# Altium schematic sheet LTE.SchDoc: LTE
size A4; DrawnBy: Muhammet YILDIZ; Organization: YıLDıZ IoT; Revision: 1.1; SheetNumber: 6; SheetTotal: 7; SheetSize: A4
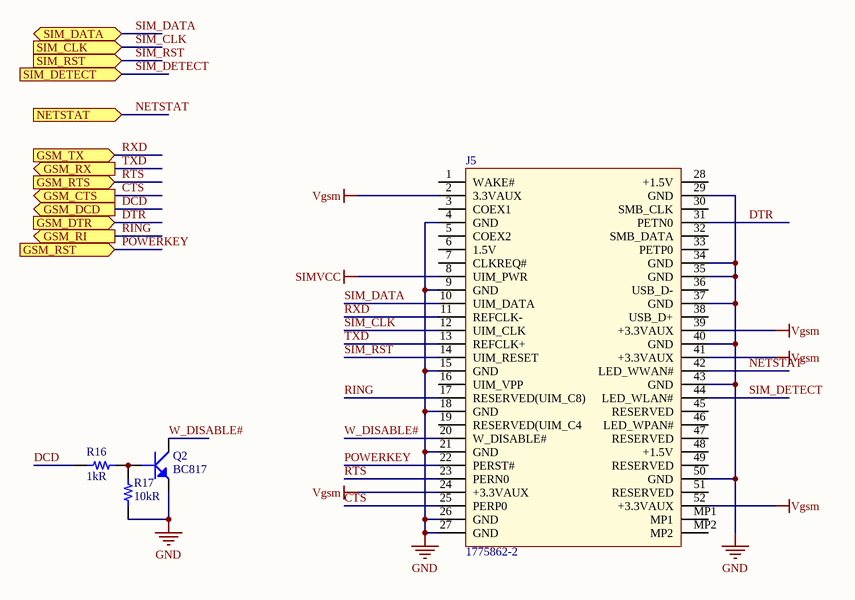
[diagram p0: LTE.SchDoc]

## Parts
J5  1775862-2  [TE 1775862-2]
Q2  BC817  [SOT23-3]
R16  1kR  [RES 0603/1608]
R17  10kR  [RES 0603/1608]

## Ports
GSM_CTS (out), GSM_DCD (out), GSM_DTR (in), GSM_RI (out), GSM_RST (in), GSM_RTS (in), GSM_RX (out), GSM_TX (in), NETSTAT (in), SIM_CLK (in), SIM_DATA (bidir), SIM_DETECT (in), SIM_RST (in)

## Nets
GND: J5.4(GND) J5.9(GND) J5.15(GND) J5.18(GND) J5.21(GND) J5.26(GND) J5.27(GND) J5.29(GND) J5.34(GND) J5.35(GND) J5.37(GND) J5.40(GND) J5.43(GND) J5.50(GND) Q2.2(E) R17.1
SIMVCC: J5.8(UIM_PWR)
Vgsm: J5.2(3.3VAUX) J5.24(+3.3VAUX) J5.39(+3.3VAUX) J5.41(+3.3VAUX) J5.52(+3.3VAUX)
CTS: J5.25(PERP0) ; port GSM_CTS
DCD: R16.2 ; port GSM_DCD
DTR: J5.31(PETN0) ; port GSM_DTR
NETSTAT: J5.42(LED_WWAN#) ; port NETSTAT
POWERKEY: J5.22(PERST#) ; port GSM_RST
RING: J5.17(RESERVED(UIM_C8)) ; port GSM_RI
RTS: J5.23(PERN0) ; port GSM_RTS
RXD: J5.11(REFCLK-) ; port GSM_TX
SIM_CLK: J5.12(UIM_CLK) ; port SIM_CLK
SIM_DATA: J5.10(UIM_DATA) ; port SIM_DATA
SIM_DETECT: J5.44(LED_WLAN#) ; port SIM_DETECT
SIM_RST: J5.14(UIM_RESET) ; port SIM_RST
TXD: J5.13(REFCLK+) ; port GSM_RX
W_DISABLE#: J5.20(W_DISABLE#) Q2.3(C)
NetQ2_1: Q2.1(B) R16.1 R17.2

Not connected (* = marked no-connect by the designer): J5 1(WAKE#) 3(COEX1) 5(COEX2) 6(1.5V) 7(CLKREQ#) 16(UIM_VPP) 19(RESERVED(UIM_C4) 28(+1.5V) 30(SMB_CLK) 32(SMB_DATA) 33(PETP0) 36(USB_D-) 38(USB_D+) 45(RESERVED) 46(LED_WPAN#) 47(RESERVED) 48(+1.5V) 49(RESERVED) 51(RESERVED) MP1 MP2

## Notes on the sheet
- Title:
- Size:
- Project:
- Revision:
- Sheet
- of
- Date:
- YıLDıZ IoT
- Elperek Mahallesi
- Saray Sokak, No:12
- SAKARYA / TURKEY
- File:

## Library data of the parts
J5 = Mini PCIe: Manufacturer: TE Connectivity; Number of Contacts: 52; Connector Type: Receptacle; High Temperature Housing: Yes; PCB Mount Retention: Without; PCB Mounting Orientation: Horizontal; Stackable: No; Pitch: 0.8mm; Row Spacing: 0.031inch; Stack Height: 5.2mm; Supplier 1: Digi-Key; Supplier Part Number 1: A142273CT-ND; Manufacturer Part Number: 1775862-2; Stock 1: 11289; Pricing 1: 1 = 0,77000, 10 = 0,72000, 25 = 0,64840, 50 = 0,57620, 100 = 0,55230, 250 = 0,50424 (USD); RoHS: Yes; Mount: Surface Mount; Contact Plating: Gold; Contact Material: Copper Alloy; Housing Material: Thermoplastic; Housing Color: Black; Termination: Solder; Number of Rows: 2; Packaging: Tape and Reel; Orientation: Right Angle; Number of Positions: 52; Package Quantity: 550; Radiation Hardening: No; Flammability Rating: UL94 V-0; Lead Free: Contains Lead; ELV: Compliant; ComponentLink1URL: http://www.farnell.com/datasheets/2645681.pdf?src-supplier=Farnell; ComponentLink1Description: http://www.farnell.com/datasheets/2645681.pdf?src-supplier=Farnell; ComponentLink2URL: http://components.arrow.com/part/dataview/0323_06583025?src-supplier=Arrow+Europe; ComponentLink2Description: http://components.arrow.com/part/dataview/0323_06583025?src-supplier=Arrow+Europe; ComponentLink3URL: http://www.onlinecomponents.com/datasheet/17758622.aspx?p=10266609&src-supplier=Onlinecomponents.com; ComponentLink3Description: http://www.onlinecomponents.com/datasheet/17758622.aspx?p=10266609&src-supplier=Onlinecomponents.com; ComponentLink4URL: http://components.arrow.com/part/dataview/47764795S8999339N5665?src-supplier=Arrow+Electronics; ComponentLink4Description: http://components.arrow.com/part/dataview/47764795S8999339N5665?src-supplier=Arrow+Electronics; ComponentLink5URL: https://www.te.com/commerce/DocumentDelivery/DDEController?Action=srchrtrv&DocNm=1775862&DocType=Customer+Drawing&DocLang=English&src-supplier=Digi-Key; ComponentLink5Description: https://www.te.com/commerce/DocumentDelivery/DDEController?Action=srchrtrv&DocNm=1775862&DocType=Customer+Drawing&DocLang=English&src-supplier=Digi-Key; ComponentLink6URL: http://www.farnell.com/datasheets/2645681.pdf?src-supplier=Element14; ComponentLink6Description: http://www.farnell.com/datasheets/2645681.pdf?src-supplier=Element14; ComponentLink7URL: https://www.te.com/commerce/DocumentDelivery/DDEController?Action=srchrtrv&amp;DocNm=1775862&amp;DocType=Customer+Drawing&amp;DocLang=English&src-supplier=Digi-Key; ComponentLink7Description: https://www.te.com/commerce/DocumentDelivery/DDEController?Action=srchrtrv&amp;DocNm=1775862&amp;DocType=Customer+Drawing&amp;DocLang=English&src-supplier=Digi-Key; ComponentLink8URL: http://www.farnell.com/datasheets/2645681.pdf?src-supplier=Newark; ComponentLink8Description: http://www.farnell.com/datasheets/2645681.pdf?src-supplier=Newark; ComponentLink9URL: http://www.te.com/commerce/DocumentDelivery/DDEController?Action=showdoc&DocId=Data+Sheet8-1773459-7_EXPRESS_MINI_CARD_QRG1011pdfEnglishENG_DS_8-1773459-7_EXPRESS_MINI_CARD_QRG_1011.pdf&src-supplier=Avnet; ComponentLink9Description: http://www.te.com/commerce/DocumentDelivery/DDEController?Action=showdoc&DocId=Data+Sheet8-1773459-7_EXPRESS_MINI_CARD_QRG1011pdfEnglishENG_DS_8-1773459-7_EXPRESS_MINI_CARD_QRG_1011.pdf&src-supplier=Avnet; ComponentLink10URL: http://www.te.com/commerce/DocumentDelivery/DDEController?Action=showdoc&DocId=Data+Sheet%7F8-1773459-7_EXPRESS_MINI_CARD_QRG%7F1011%7Fpdf%7FEnglish%7FENG_DS_8-1773459-7_EXPRESS_MINI_CARD_QRG_1011.pdf&src-supplier=Avnet+Europe; ComponentLink10Description: http://www.te.com/commerce/DocumentDelivery/DDEController?Action=showdoc&DocId=Data+Sheet%7F8-1773459-7_EXPRESS_MINI_CARD_QRG%7F1011%7Fpdf%7FEnglish%7FENG_DS_8-1773459-7_EXPRESS_MINI_CARD_QRG_1011.pdf&src-supplier=Avnet+Europe; ComponentLink11URL: http://www.te.com/commerce/DocumentDelivery/DDEController?Action=showdoc&DocId=Data+Sheet8-1773459-7_EXPRESS_MINI_CARD_QRG1011pdfEnglishENG_DS_8-1773459-7_EXPRESS_MINI_CARD_QRG_1011.pdf&src-supplier=Avnet+Asia; ComponentLink11Description: http://www.te.com/commerce/DocumentDelivery/DDEController?Action=showdoc&DocId=Data+Sheet8-1773459-7_EXPRESS_MINI_CARD_QRG1011pdfEnglishENG_DS_8-1773459-7_EXPRESS_MINI_CARD_QRG_1011.pdf&src-supplier=Avnet+Asia
Q2 = BC817: Transistor, BC817; Manufacturer: ON Semiconductor; Manufacturer Part Number: BC817-16LT1G; Transistor Type: NPN; Vce Saturation (Max) @ Ib, Ic: 700mV @ 50mA, 500mA; Current - Collector Cutoff (Max): 100nA (ICBO); DC Current Gain (hFE) (Min) @ Ic, Vce: 100 @ 100mA, 1V; Frequency - Transition: 100MHz; Supplier 1: Digi-Key; Supplier Part Number 1: BC817-16LT1GOSCT-ND; RoHS: RoHS Compliant; Category: Discrete Semiconductor Products; Stock 1: 46603; Pricing 1: 1=0.13, 10=0.118, 100=0.0642, 500=0.0395, 1000=0.02693 (USD); Packaging: Cut Tape (CT); Part Status: Active; Operating Temperature: -65°C ~ 150°C (TJ); Mounting Type: Surface Mount; Package / Case: TO-236-3, SC-59, SOT-23-3; Supplier Device Package: SOT-23-3 (TO-236); Base Part Number: BC817; ComponentLink1URL: http://www.onsemi.com/pub/Collateral/BC817-16LT1-D.PDF; ComponentLink1Description: http://www.onsemi.com/pub/Collateral/BC817-16LT1-D.PDF; Price: 0,13
R16 = Resistor_Chip: Ceramic, SMT Capacitor; Manufacturer: Rohm; Manufacturer Part Number: ESR03EZPJ102; Tolerance: 5%; Temperature Coefficient: 200ppm/°C; Max Power Dissipation: 250mW; Supplier 1: Digi-Key; Supplier Part Number 1: RHM1.0KDCT-ND; Stock 1: 148117; Pricing 1: 1 = 0,10000, 10 = 0,08300, 100 = 0,03180, 1000 = 0,01398, 2500 = 0,01207 (USD); RoHS: Yes; Case/Package: 0603; Case Code (Metric): 1608; Case Code (Imperial): 0603; Min Operating Temperature: -55°C; Max Operating Temperature: 155°C; Resistance: 1kR; Package Quantity: 1; Packaging: Tape and Reel; Composition: Thick Film; Number of Terminations: 2; Features: Automotive AEC-Q200; Length: 0.063inch; Height: 0.022inch; Width: 0.031inch; Lead Free: Lead Free; ComponentLink1URL: https://datasheet.ciiva.com/2469/esr-2469603.pdf?src-supplier=Digi-Key; ComponentLink1Description: https://datasheet.ciiva.com/2469/esr-2469603.pdf?src-supplier=Digi-Key; ComponentLink2URL: https://datasheet.ciiva.com/2469/esr-2469604.pdf?src-supplier=Digi-Key; ComponentLink2Description: https://datasheet.ciiva.com/2469/esr-2469604.pdf?src-supplier=Digi-Key; ComponentLink3URL: https://datasheet.ciiva.com/2469/esr-2469605.pdf?src-supplier=Digi-Key; ComponentLink3Description: https://datasheet.ciiva.com/2469/esr-2469605.pdf?src-supplier=Digi-Key
R17 = Resistor_Chip: Ceramic, SMT Capacitor; Manufacturer: Stackpole Electronics; Manufacturer Part Number: RNCP0603FTD10K0; Tolerance: 1%; Max Power Dissipation: 125mW; Temperature Coefficient: 100ppm/°C; Supplier 1: Digi-Key; Supplier Part Number 1: RNCP0603FTD10K0CT-ND; Stock 1: 183083; Pricing 1: 1 = 0,10000, 10 = 0,06700, 100 = 0,02730, 1000 = 0,01224, 2500 = 0,01063 (USD); RoHS: Yes; Mount: Surface Mount; Case/Package: 0603; Case Code (Metric): 1608; Case Code (Imperial): 0603; Contact Plating: Matte,Tin; Min Operating Temperature: -55°C; Max Operating Temperature: 155°C; Packaging: Tape and Reel; Resistance: 10kR; Composition: Thin Film; Number of Terminations: 2; Features: Anti-Sulfur,Moisture Resistant; Length: 0.059inch; Height: 0.02inch; Width: 0.031inch; Radiation Hardening: No; Lead Free: Lead Free